# EAGLE schematic ESP32-Proto2-LayoutA (EAGLE 9.6.2)
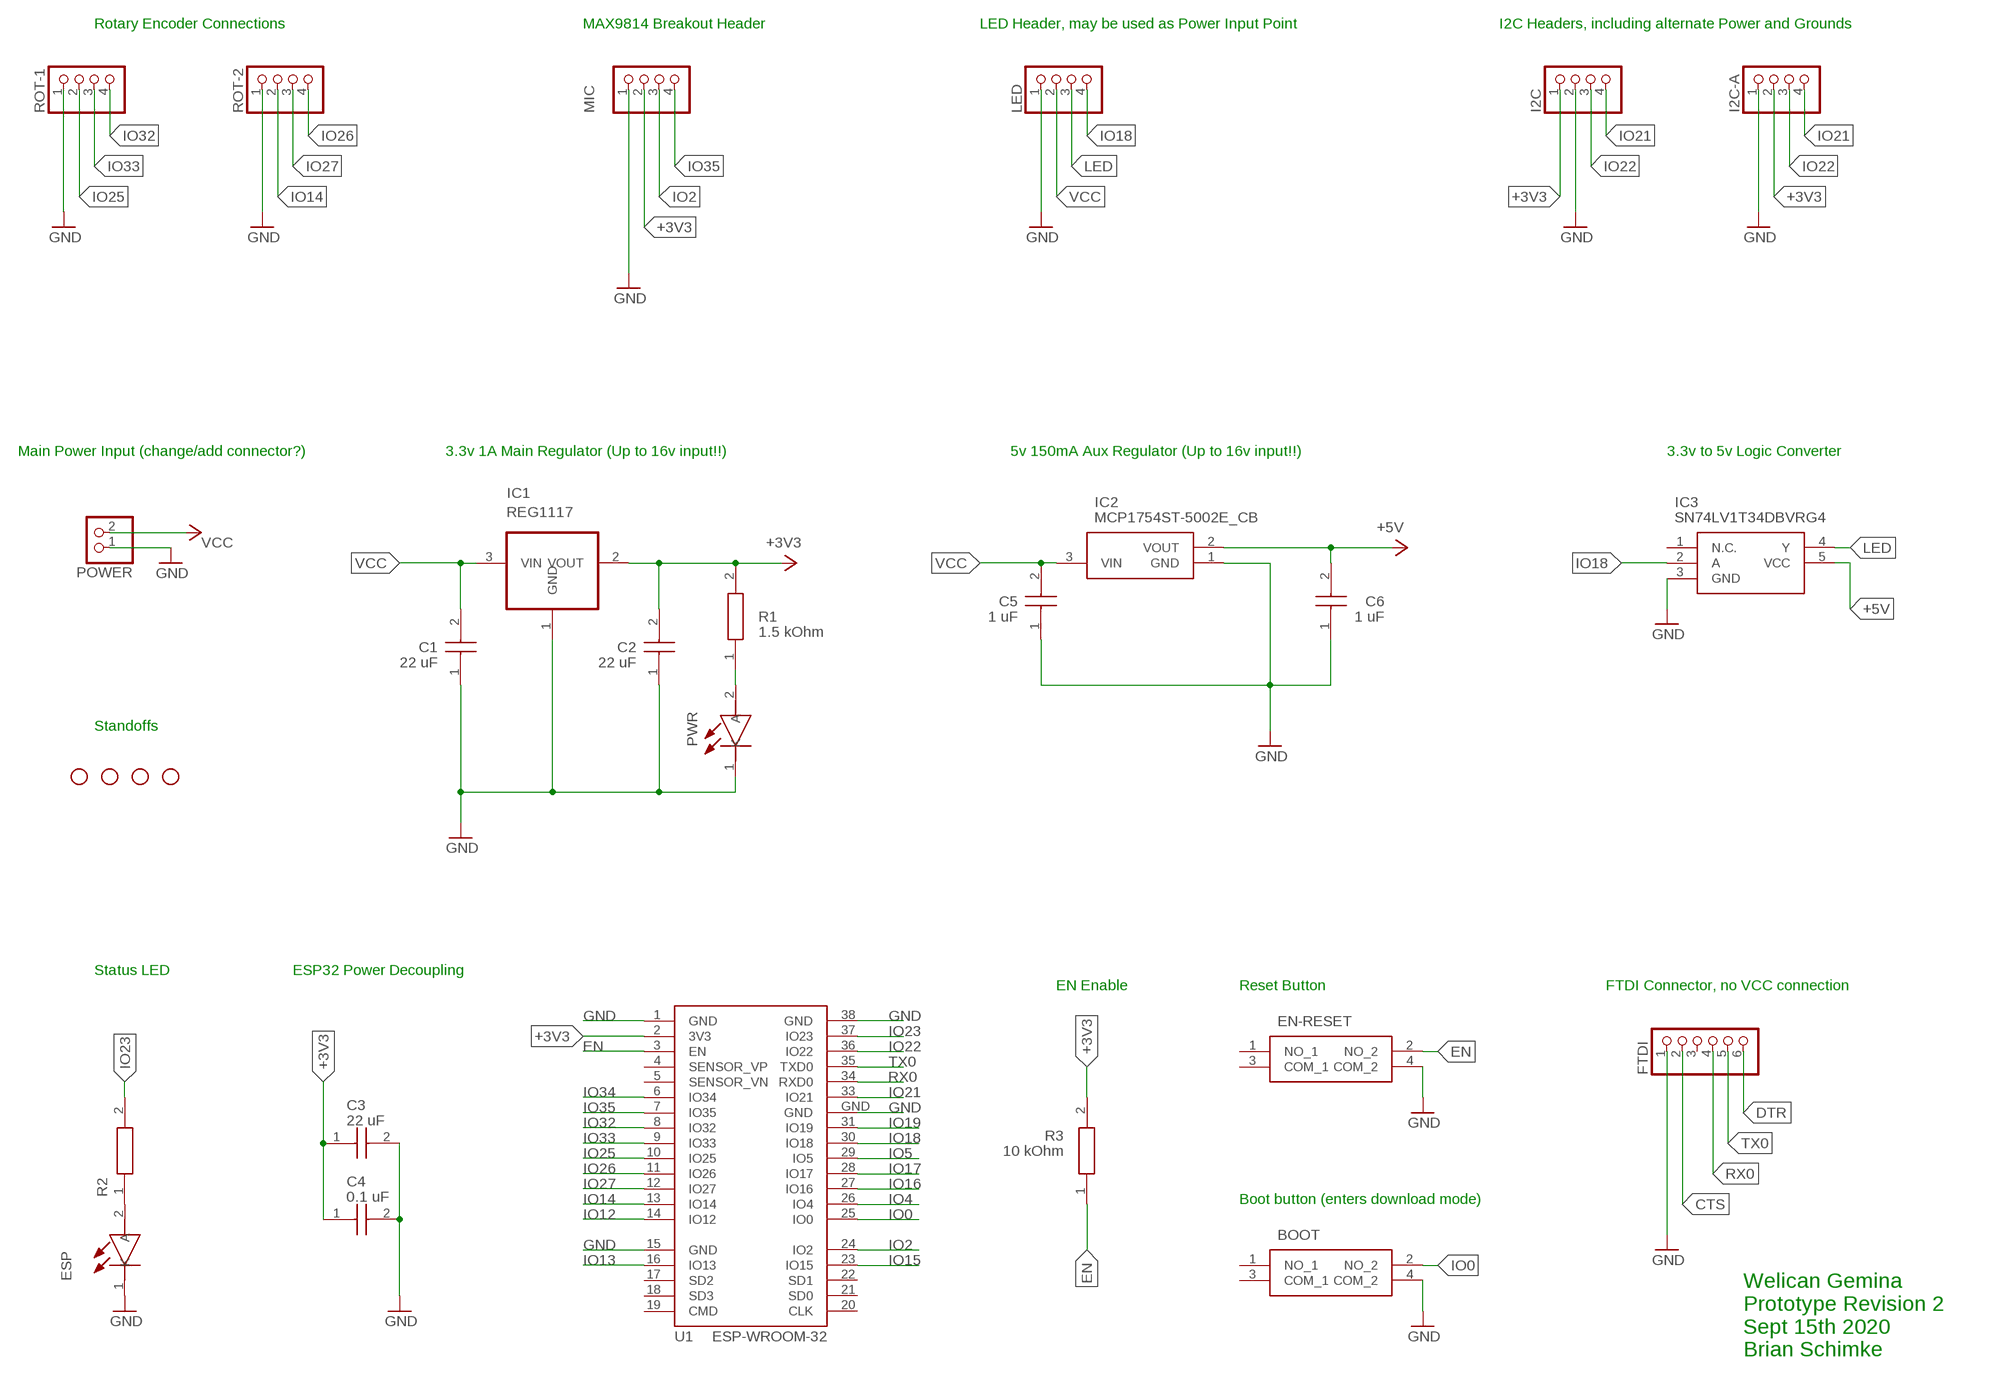
[diagram p0: schematic, sheet 1]

## Parts
BOOT  PTS647SK70SMTR2LFS  [PTS647SK70SMTR2LFS]
C1  22 uF  C1206C226M4PACTU  [CAPC3216X180N]
C2  22 uF  C1206C226M4PACTU  [CAPC3216X180N]
C3  22 uF  C1206C226M4PACTU  [CAPC3216X180N]
C4  0.1 uF  C1206C226M4PACTU  [CAPC3216X180N]
C5  1 uF  C1206C226M4PACTU  [CAPC3216X180N]
C6  1 uF  C1206C226M4PACTU  [CAPC3216X180N]
EN-RESET  PTS647SK70SMTR2LFS  [PTS647SK70SMTR2LFS]
ESP  150120AS75000  [LEDSC320X160X78-2N]
FTDI  PINHD-1X6  [1X06]
H1  STAND-OFF  [STAND-OFF]
H2  STAND-OFF  [STAND-OFF]
H3  STAND-OFF  [STAND-OFF]
H4  STAND-OFF  [STAND-OFF]
I2C  PINHD-1X4  [1X04]
I2C-A  PINHD-1X4  [1X04]
IC1  REG1117  [SOT223]
IC2  MCP1754ST-5002E_CB  [SOT95P255X145-3N]
IC3  SN74LV1T34DBVRG4  [SOT95P280X145-5N]
LED  PINHD-1X4  [1X04]
MIC  PINHD-1X4  [1X04]
POWER  PINHD-1X2  [1X02]
PWR  150120AS75000  [LEDSC320X160X78-2N]
R1  1.5 kOhm  CRCW12061K00FKEB  [RESC3216X60N]
R2  CRCW12061K00FKEB  [RESC3216X60N]
R3  10 kOhm  CRCW12061K00FKEB  [RESC3216X60N]
ROT-1  PINHD-1X4  [1X04]
ROT-2  PINHD-1X4  [1X04]
U1  ESP-WROOM-32  [ESP-WROOM-32]

## Nets
+3V3: C2.2 C3.1 C4.1 I2C-A.2 I2C.1 IC1.2(VOUT) MIC.2 R1.2 R3.2 U1.2(3V3)
+5V: C6.2 IC2.2(VOUT) IC3.5(VCC)
CTS: FTDI.2
DTR: FTDI.6
EN: EN-RESET.2(NO_2) R3.1 U1.3(EN)
GND: BOOT.4(COM_2) C1.1 C2.1 C3.2 C4.2 C5.1 C6.1 EN-RESET.4(COM_2) ESP.1(K) FTDI.1 I2C-A.1 I2C.2 IC1.1(GND) IC2.1(GND) IC3.3(GND) LED.1 MIC.1 POWER.1 PWR.1(K) ROT-1.1 ROT-2.1 U1.1(GND) U1.15(GND) U1.38(GND) U1.GND
IO0: BOOT.2(NO_2) U1.25(IO0)
IO2: MIC.3 U1.24(IO2)
IO4: U1.26(IO4)
IO5: U1.29(IO5)
IO12: U1.14(IO12)
IO13: U1.16(IO13)
IO14: ROT-2.2 U1.13(IO14)
IO15: U1.23(IO15)
IO16: U1.27(IO16)
IO17: U1.28(IO17)
IO18: IC3.2(A) LED.4 U1.30(IO18)
IO19: U1.31(IO19)
IO21: I2C-A.4 I2C.4 U1.33(IO21)
IO22: I2C-A.3 I2C.3 U1.36(IO22)
IO23: R2.2 U1.37(IO23)
IO25: ROT-1.2 U1.10(IO25)
IO26: ROT-2.4 U1.11(IO26)
IO27: ROT-2.3 U1.12(IO27)
IO32: ROT-1.4 U1.8(IO32)
IO33: ROT-1.3 U1.9(IO33)
IO34: U1.6(IO34)
IO35: MIC.4 U1.7(IO35)
LED: IC3.4(Y) LED.3
N$1: PWR.2(A) R1.1
N$2: ESP.2(A) R2.1
RX0: FTDI.4 U1.34(RXD0)
TX0: FTDI.5 U1.35(TXD0)
VCC: C1.2 C5.2 IC1.3(VIN) IC2.3(VIN) LED.2 POWER.2
Unconnected: BOOT.1(NO_1) BOOT.3(COM_1) EN-RESET.1(NO_1) EN-RESET.3(COM_1) FTDI.3 IC3.1(N.C.) U1.4(SENSOR_VP) U1.5(SENSOR_VN) U1.17(SD2) U1.18(SD3) U1.19(CMD) U1.20(CLK) U1.21(SD0) U1.22(SD1)

## Notes on the sheet
- Rotary Encoder Connections | MAX9814 Breakout Header | LED Header, may be used as Power Input Point | I2C Headers, including alternate Power and Grounds
- Main Power Input (change/add connector?) | 3.3v 1A Main Regulator (Up to 16v input!!) | 5v 150mA Aux Regulator (Up to 16v input!!) | 3.3v to 5v Logic Converter
- Standoffs
- Status LED | ESP32 Power Decoupling
- EN Enable | Reset Button | FTDI Connector, no VCC connection
- Boot button (enters download mode)
- Welican Gemina
  Prototype Revision 2
  Sept 15th 2020
  Brian Schimke

## Library data of the parts
BOOT EN-RESET = SamacSys_Parts:PTS647SK70SMTR2LFS: Tactile Switches 50mA 12VDC, 2.5N 7.0mm H, G leads Source: Datasheet <https:////www.ckswitches.com/media/2567/pts647.pdf>; DESCRIPTION: Tactile Switches 50mA 12VDC, 2.5N 7.0mm H, G leads; HEIGHT: 7.2mm; MANUFACTURER_NAME: C & K COMPONENTS; MANUFACTURER_PART_NUMBER: PTS647SK70SMTR2LFS; MOUSER_PART_NUMBER: 611-PTS647SK70SMTR2L; MOUSER_PRICE-STOCK: https://www.mouser.co.uk/ProductDetail/CK/PTS647SK70SMTR2LFS?qs=PqoDHHvF64%2FG2CdR6DYUFw%3D%3D
C1-C6 = SamacSys_Parts:C1206C226M4PACTU: KEMET 1206 (3216M) 22uF MLCC 16V dc +/-20% SMD C1206C226M4PACTU Source: Datasheet <https://api.kemet.com/component-edge/download/specsheet/C1206C226M4PACTU.pdf>; DESCRIPTION: KEMET 1206 (3216M) 22uF MLCC 16V dc +/-20% SMD C1206C226M4PACTU; HEIGHT: 1.8mm; MANUFACTURER_NAME: Kemet; MANUFACTURER_PART_NUMBER: C1206C226M4PACTU; MOUSER_PART_NUMBER: 80-C1206C226M4P; MOUSER_PRICE-STOCK: https://www.mouser.co.uk/ProductDetail/KEMET/C1206C226M4PACTU?qs=vBH1GPjCw2UZFSd%252B4IU1Qg%3D%3D
ESP PWR = SamacSys_Parts:150120AS75000: WL-SMCW SMD chip LED top view monocolor%D waterclear Source: Datasheet <http://katalog.we-online.com/led/datasheet/150120AS75000.pdf>; DESCRIPTION: WL-SMCW SMD chip LED top view monocolor%D waterclear; HEIGHT: mm; MANUFACTURER_NAME: Wurth Elektronik; MANUFACTURER_PART_NUMBER: 150120AS75000; MOUSER_PART_NUMBER: 710-150120AS75000; MOUSER_PRICE-STOCK: https://www.mouser.co.uk/ProductDetail/Wurth-Elektronik/150120AS75000?qs=LlUlMxKIyB3dthGDbNsiXQ%3D%3D
FTDI = pinhead:PINHD-1X6: PIN HEADER
H1-H4 = SparkFun-Hardware:STAND-OFF: Stand Off Drill holes for mechanically mounting via screws, standoffs, etc. Note: Use the keepout ring to avoid running the screw head into surrounding components. Variant Overviews STAND-OFF - Mechanical footprint for a #4 phillips button head screw. STAND-OFF-TIGHT - Mechanical footprint for a #4 phillips button head screw, Example SparkFun Products Screw - Phillips Head (1/4", 4-40, 10 pack) <https://www.sparkfun.com/products/10453> (PRT-10453) Screw - Phillips Head (1/2", 4-40, 10 pack) <https://www.sparkfun.com/products/10452> (PRT-10452) Screw - Phillips Head (3/4", 4-40, 10 pack) <https://www.sparkfun.com/products/10451> (PRT-10451) Screw - Phillips Head (1", 4-40, 10 pack) <https://www.sparkfun.com/products/10450> (PRT-10450)
I2C I2C-A LED MIC ROT-1 ROT-2 = pinhead:PINHD-1X4: PIN HEADER
IC1 = burr-brown:REG1117: 800mA and 1A Low Dropout (LDO) Positive Regulator 1.8V, 2.5V, 2.85V, 3.3V, 5V, and Adj; MPN: REG1117; OC_FARNELL: 1097566; OC_NEWARK: 14P6981
IC2 = SamacSys_Parts:MCP1754ST-5002E_CB: LDO regulator,voltage,5.0V,150mA,SOT23A Microchip MCP1754ST-5002E/CB, Single Linear Voltage Regulator, 150mA 5 V, 2%, 3-Pin SOT-23A Source: Datasheet; DESCRIPTION: LDO regulator,voltage,5.0V,150mA,SOT23A Microchip MCP1754ST-5002E/CB, Single Linear Voltage Regulator, 150mA 5 V, 2%, 3-Pin SOT-23A; HEIGHT: 1.45mm; MANUFACTURER_NAME: Microchip; MANUFACTURER_PART_NUMBER: MCP1754ST-5002E/CB; MOUSER_PART_NUMBER: 579-MCP1754T-5002ECB; MOUSER_PRICE-STOCK: https://www.mouser.co.uk/ProductDetail/Microchip-Technology/MCP1754ST-5002E-CB?qs=geWWqIMx8YpBnNSotTcMsA%3D%3D
IC3 = SamacSys_Parts:SN74LV1T34DBVRG4: Single Power Supply BUFFER Logic Level Shifter (no enable) Source: Datasheet <http://www.ti.com/lit/gpn/sn74lv1t34>; DESCRIPTION: Single Power Supply BUFFER Logic Level Shifter (no enable); HEIGHT: 1.45mm; MANUFACTURER_NAME: Texas Instruments; MANUFACTURER_PART_NUMBER: SN74LV1T34DBVRG4; MOUSER_PART_NUMBER: 595-SN74LV1T34DBVRG4; MOUSER_PRICE-STOCK: https://www.mouser.co.uk/ProductDetail/Texas-Instruments/SN74LV1T34DBVRG4?qs=vdi0iO8H4N10R%252Bt%252BjmxZrg%3D%3D
POWER = pinhead:PINHD-1X2: PIN HEADER
R1-R3 = SamacSys_Parts:CRCW12061K00FKEB: Thick Film Resistors - SMD 1/4watt 1Kohms 1% Source: Datasheet <http://www.vishay.com/docs/20035/dcrcwe3.pdf>; DESCRIPTION: Thick Film Resistors - SMD 1/4watt 1Kohms 1%; HEIGHT: 0.6mm; MANUFACTURER_NAME: Vishay; MANUFACTURER_PART_NUMBER: CRCW12061K00FKEB; MOUSER_PART_NUMBER: 71-CRCW12061K00FKEB; MOUSER_PRICE-STOCK: https://www.mouser.co.uk/ProductDetail/Vishay-Dale/CRCW12061K00FKEB?qs=3XLFQ9LoC1wOYUVdt2fbOg%3D%3D
U1 = esp32:ESP-WROOM-32: Espressif Systems ESP-WROOM-32